# Altium schematic sheet Signal_Switching.SchDoc
size A4; SheetNumber: 2; SheetTotal: 6
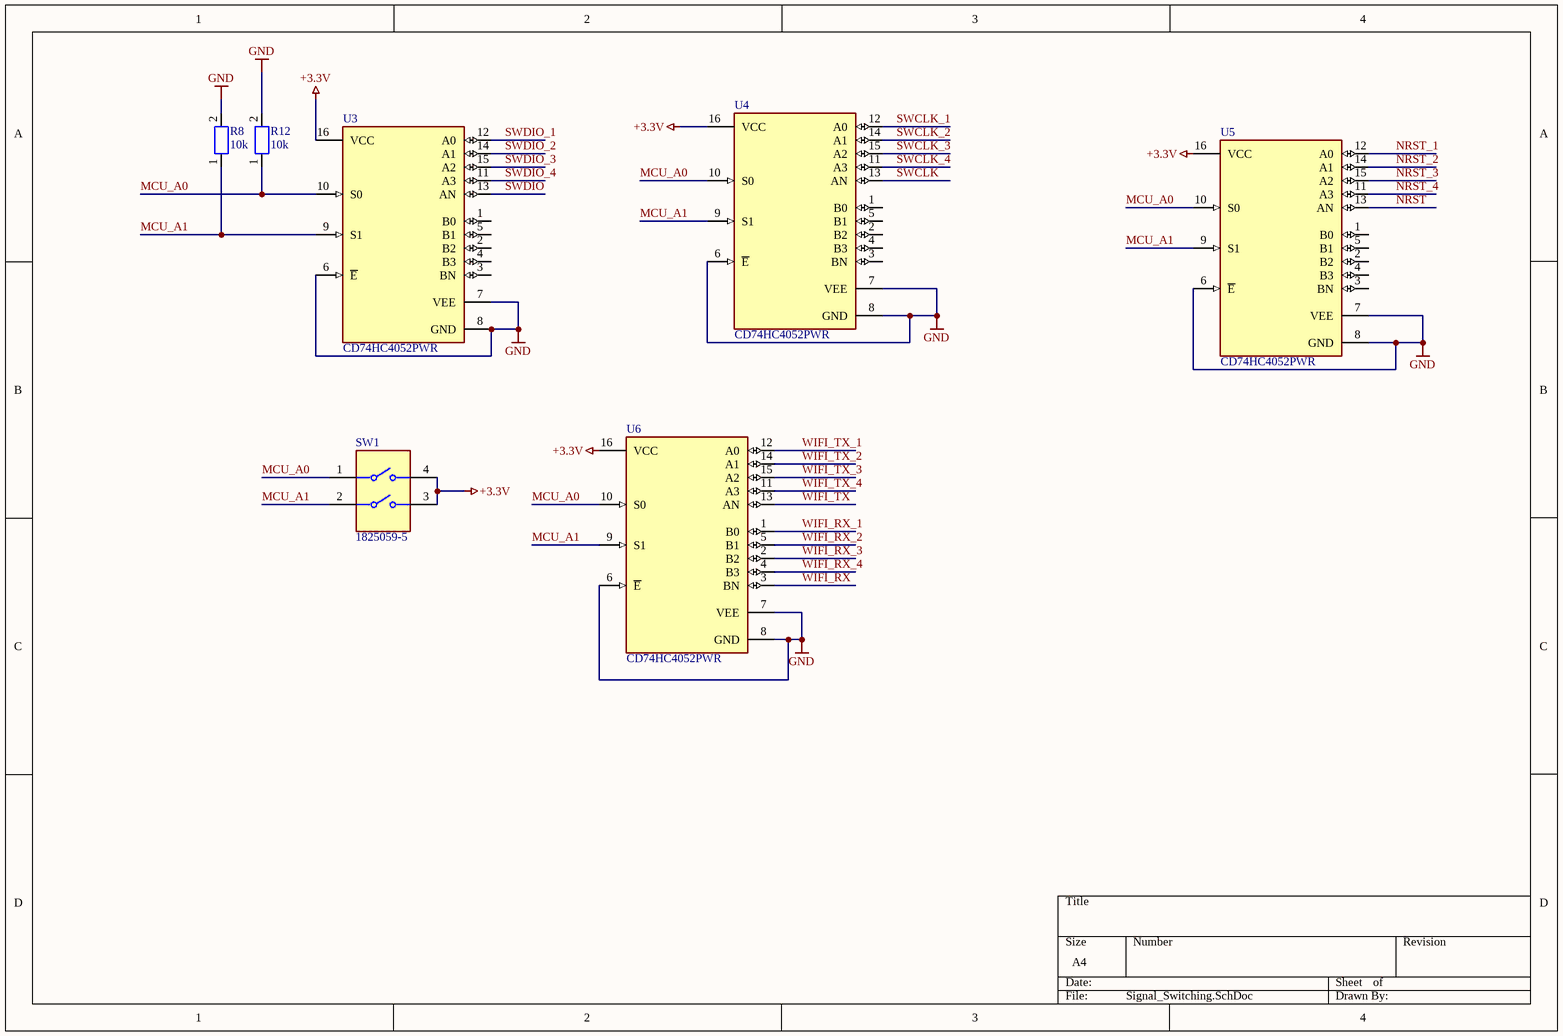
[diagram p0: Signal_Switching.SchDoc]

## Parts
R8  10k  [FP-CRGP0805-IPC_A]
R12  10k  [FP-CRGP0805-IPC_A]
SW1  1825059-5  [FP-1825059-5-MFG]
U3  CD74HC4052PWR  [FP-PW0016A-MFG]
U4  CD74HC4052PWR  [FP-PW0016A-MFG]
U5  CD74HC4052PWR  [FP-PW0016A-MFG]
U6  CD74HC4052PWR  [FP-PW0016A-MFG]

## Nets
+3.3V: SW1.3 SW1.4 U3.16(VCC) U4.16(VCC) U5.16(VCC) U6.16(VCC)
GND: R8.2 R12.2 U3.6(~{E}) U3.7(VEE) U3.8(GND) U4.6(~{E}) U4.7(VEE) U4.8(GND) U5.6(~{E}) U5.7(VEE) U5.8(GND) U6.6(~{E}) U6.7(VEE) U6.8(GND)
MCU_A0: R12.1 SW1.1 U3.10(S0) U4.10(S0) U5.10(S0) U6.10(S0)
MCU_A1: R8.1 SW1.2 U3.9(S1) U4.9(S1) U5.9(S1) U6.9(S1)
NRST: U5.13(AN)
NRST_1: U5.12(A0)
NRST_2: U5.14(A1)
NRST_3: U5.15(A2)
NRST_4: U5.11(A3)
SWCLK: U4.13(AN)
SWCLK_1: U4.12(A0)
SWCLK_2: U4.14(A1)
SWCLK_3: U4.15(A2)
SWCLK_4: U4.11(A3)
SWDIO: U3.13(AN)
SWDIO_1: U3.12(A0)
SWDIO_2: U3.14(A1)
SWDIO_3: U3.15(A2)
SWDIO_4: U3.11(A3)
WIFI_RX: U6.3(BN)
WIFI_RX_1: U6.1(B0)
WIFI_RX_2: U6.5(B1)
WIFI_RX_3: U6.2(B2)
WIFI_RX_4: U6.4(B3)
WIFI_TX: U6.13(AN)
WIFI_TX_1: U6.12(A0)
WIFI_TX_2: U6.14(A1)
WIFI_TX_3: U6.15(A2)
WIFI_TX_4: U6.11(A3)

Not connected (* = marked no-connect by the designer): U3 1(B0) 2(B2) 3(BN) 4(B3) 5(B1); U4 1(B0) 2(B2) 3(BN) 4(B3) 5(B1); U5 1(B0) 2(B2) 3(BN) 4(B3) 5(B1)

## Library data of the parts
R8 R12 = CMP-03211-006861-1: CRGP 0805 10K 1%; Manufacturer Part Number: CRGP0805F10K; Manufacturer: TE; Power Rating: 0.33W; Voltage Rating: 150V; Value: 10KΩ; Tolerance: 0.01; Temperature Coefficient: ±100ppm/°C; ComponentLink2URL: https://www.mouser.com/datasheet/2/418/NG_DS_9-1773463-9_A-1358566.pdf; Temperature Range Low: -55°C; Ipc Land Pattern Name: RESC200125X55; Device Class L2: Resistors; Automotive: No; Device Class L3: Chip SMD Resistors; Composition: Thick Film; Temperature Range High: +155°C; Temperature: -55°C to +155°C; Height: 0.65mm; Series: CRGP; RoHS: TRUE; Device Class L1: Passive Components; Octopart: https://octopart.com/crgp0805f10k-te+connectivity-91018782; Package: CRGP0805; Digikey Description: CRGP 0805 10K 1%; Ambient Temperature Range High: +70°C; Lead Free: Yes; ComponentLink2Description: Datasheet; Category: Res; Resistance: 10KΩ
SW1 = CMP-03400-000020-1: SWITCH SLIDE DIP SPST 100MA 24V; Number of Circuits: 2; Contact Current Rating: 1A; Actuator Type: Standard; Washable: Yes; Sealable: Yes (With); Pitch: 0.1inch; Voltage Rating (DC): 5V; RoHS Compliant: Yes; Max Voltage Rating (DC): 24V; Max Current Rating: 100mA; Throw Configuration: SPST; Housing Color: Black; Type: Switch; ELV: Compliant; Flammability Rating: UL94 V-0; Max Operating Temperature: 85°C; Termination: Gull Wing; Mount: Surface Mount; Contact Material: Copper Alloy; Length: 7.06mm; Radiation Hardening: No; Packaging: Rail/Tube; Lead Free: Lead Free; Package Quantity: 60; Min Operating Temperature: -30°C; Contact Plating: Gold; Height: 0.138inch; Housing Material: Polyphenylene; Series: ADF, Alcoswitch; Orientation: Straight; Number of Positions: 2
U3-U6 = CMP-1575-00095-5: IC MUX/DEMUX DUAL 4X1 16TSSOP; Throw Configuration: SP4T; Turn-Off Delay Time: 250ns; Low Level Output Current: 25mA; Polarity: Non-Inverting; Min Supply Voltage: 2V; Logic Function: Multiplexer; Max Supply Voltage: 6V; Propagation Delay: 60ns; Max Dual Supply Voltage: 5V; Turn-On Delay Time: 325ns; Supply Type: Single; Number of Bits: 4; Number of Inputs: 8; On-State Resistance: 130R; Number of Outputs: 2; Nominal Supply Current: 16uA; Bandwidth: 185MHz; Dual Supply Voltage: 3V; Min Dual Supply Voltage: 1V; Lead Free: Lead Free; Min Operating Temperature: -55°C; Contact Plating: Gold; Length: 5mm; Case/Package: TSSOP; Mount: Surface Mount; Package Quantity: 1; Number of Channels: 2; Radiation Hardening: No; Packaging: Tape and Reel; Number of Pins: 16; Width: 4.4mm; High Level Output Current: 25mA; Max Operating Temperature: 125°C; Weight: 0.002183oz; Number of Circuits: 2; REACH SVHC: No SVHC; Height: 1.15mm